# Altium schematic sheet DAM10_Relays.SchDoc
size A3
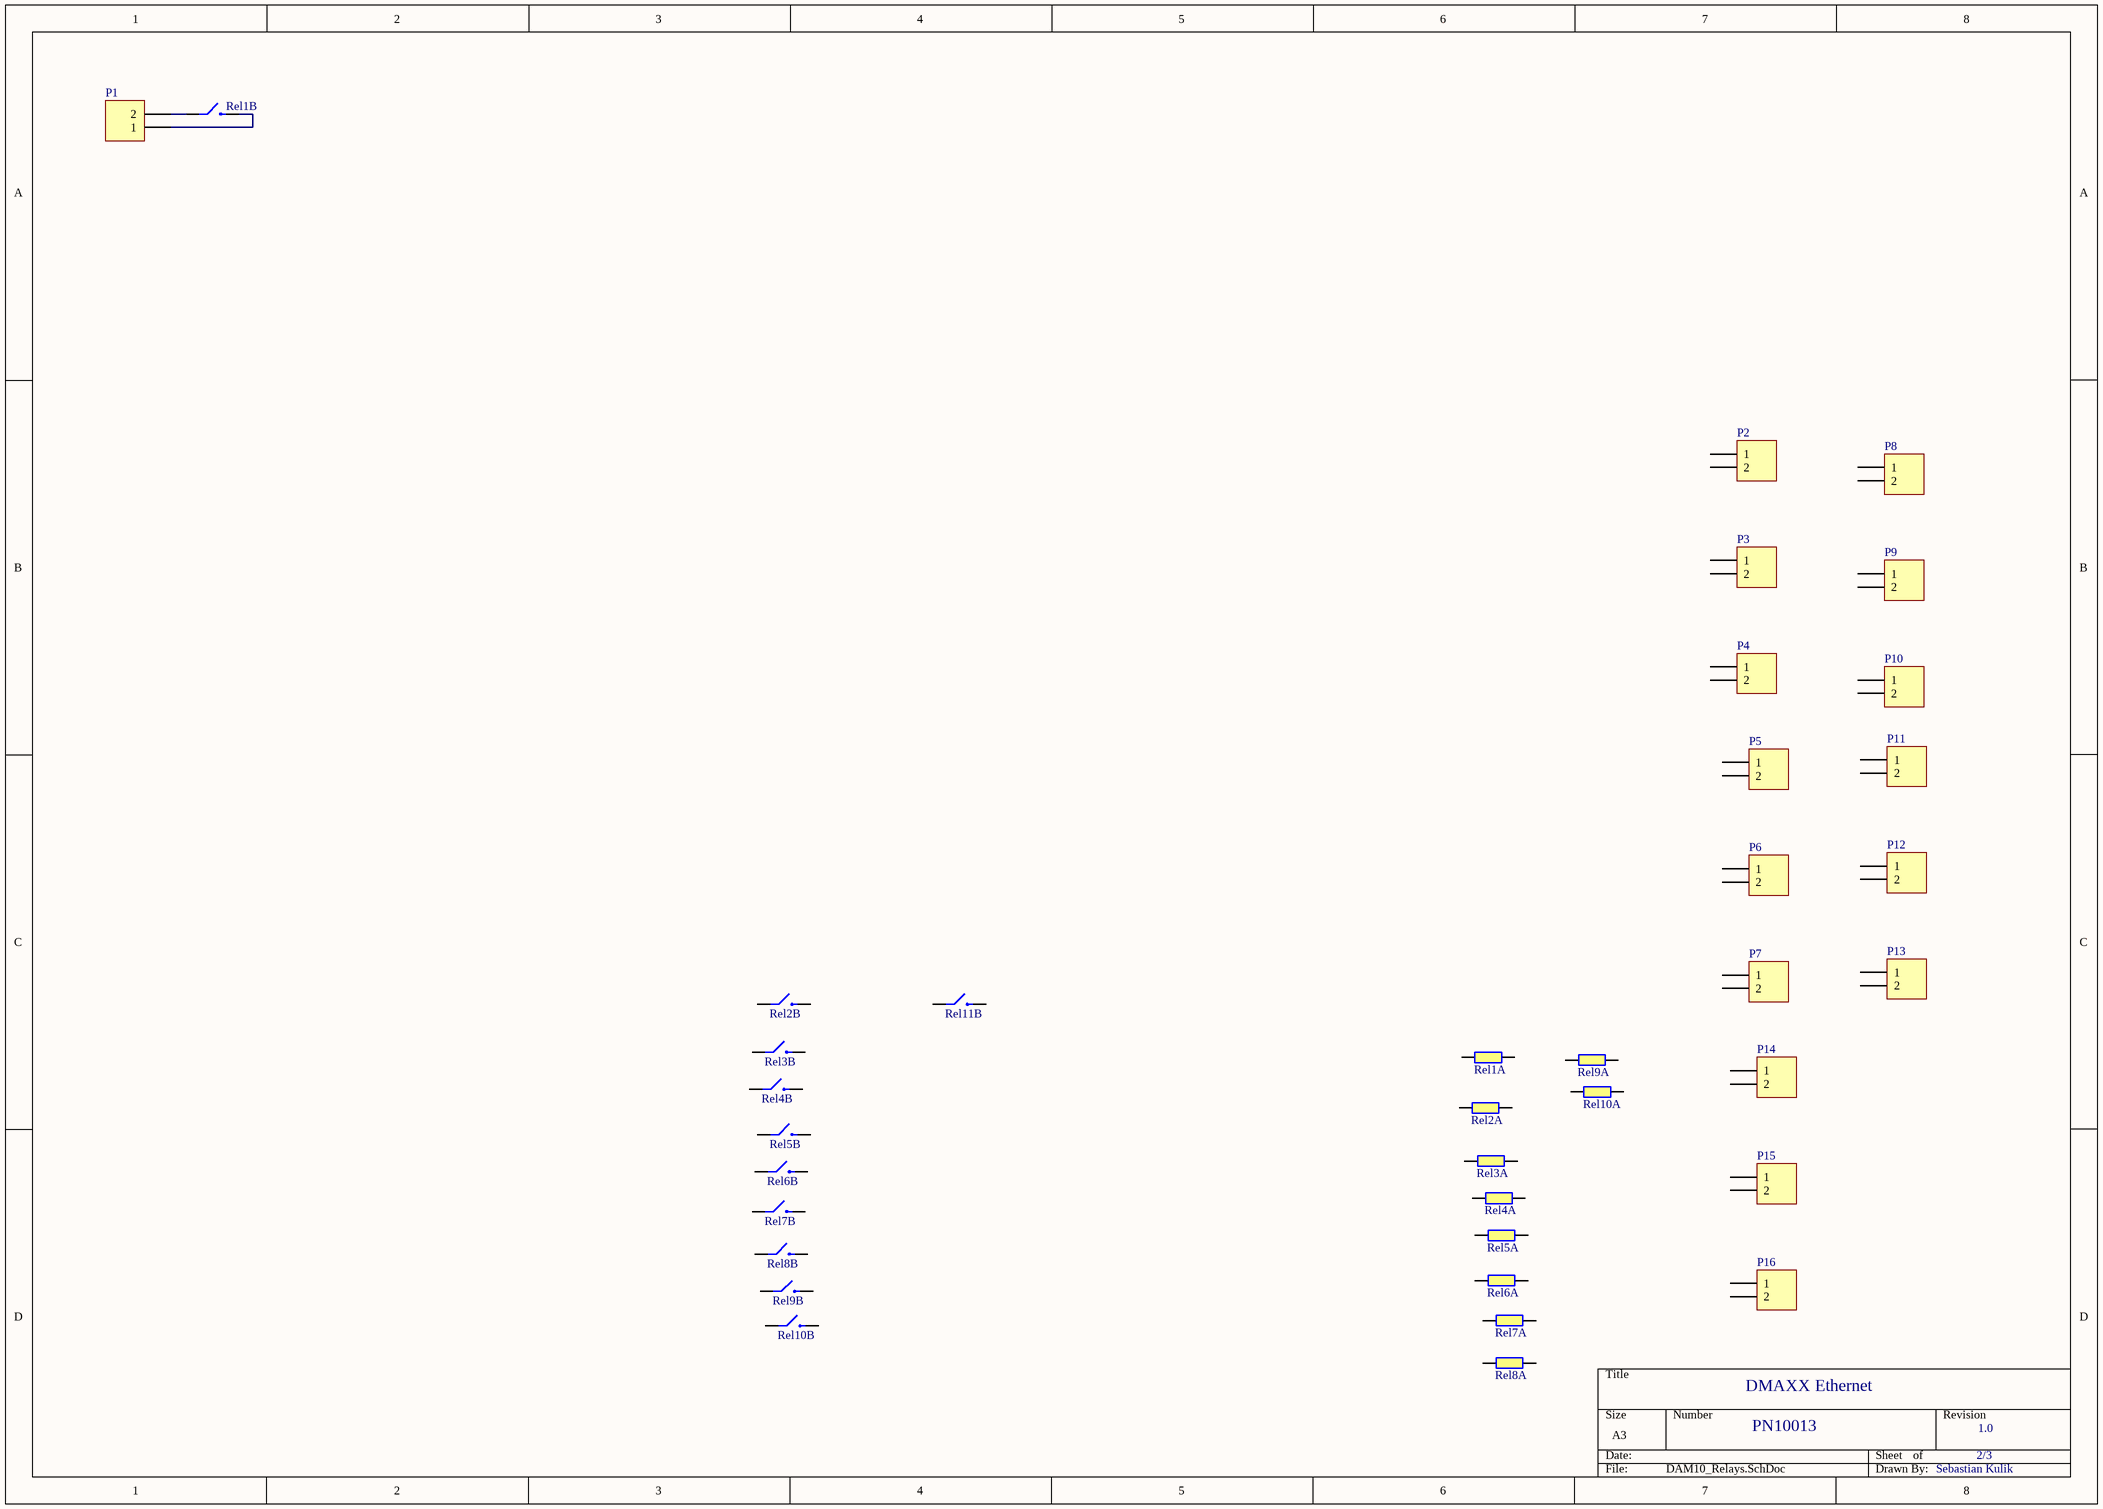
[diagram p0: DAM10_Relays.SchDoc]

## Parts
P1  PHOENIX_1715721  [Phoenix-2-5_08]  (value not drawn)
P2  PHOENIX_1715721  [Phoenix-2-5_08]  (value not drawn)
P3  PHOENIX_1715721  [Phoenix-2-5_08]  (value not drawn)
P4  PHOENIX_1715721  [Phoenix-2-5_08]  (value not drawn)
P5  PHOENIX_1715721  [Phoenix-2-5_08]  (value not drawn)
P6  PHOENIX_1715721  [Phoenix-2-5_08]  (value not drawn)
P7  PHOENIX_1715721  [Phoenix-2-5_08]  (value not drawn)
P8  PHOENIX_1715721  [Phoenix-2-5_08]  (value not drawn)
P9  PHOENIX_1715721  [Phoenix-2-5_08]  (value not drawn)
P10  PHOENIX_1715721  [Phoenix-2-5_08]  (value not drawn)
P11  PHOENIX_1715721  [Phoenix-2-5_08]  (value not drawn)
P12  PHOENIX_1715721  [Phoenix-2-5_08]  (value not drawn)
P13  PHOENIX_1715721  [Phoenix-2-5_08]  (value not drawn)
P14  PHOENIX_1715721  [Phoenix-2-5_08]  (value not drawn)
P15  PHOENIX_1715721  [Phoenix-2-5_08]  (value not drawn)
P16  PHOENIX_1715721  [Phoenix-2-5_08]  (value not drawn)
Rel1  Finder-43_41-Rel  [Finder-43_41 series]  (value not drawn)  (parts A,B of 2)
Rel2  Finder-43_41-Rel  [Finder-43_41 series]  (value not drawn)  (parts A,B of 2)
Rel3  Finder-43_41-Rel  [Finder-43_41 series]  (value not drawn)  (parts A,B of 2)
Rel4  Finder-43_41-Rel  [Finder-43_41 series]  (value not drawn)  (parts A,B of 2)
Rel5  Finder-43_41-Rel  [Finder-43_41 series]  (value not drawn)  (parts A,B of 2)
Rel6  Finder-43_41-Rel  [Finder-43_41 series]  (value not drawn)  (parts A,B of 2)
Rel7  Finder-43_41-Rel  [Finder-43_41 series]  (value not drawn)  (parts A,B of 2)
Rel8  Finder-43_41-Rel  [Finder-43_41 series]  (value not drawn)  (parts A,B of 2)
Rel9  Finder-43_41-Rel  [Finder-43_41 series]  (value not drawn)  (parts A,B of 2)
Rel10  Finder-43_41-Rel  [Finder-43_41 series]  (value not drawn)  (parts A,B of 2)
Rel11  Finder-43_41-Rel  [Finder-43_41 series]  (value not drawn)  (part B of 2)

## Nets
NetP1_1: P1.1 Rel1.4
NetP1_2: P1.2 Rel1.3

Not connected (* = marked no-connect by the designer): P2 1 2; P3 1 2; P4 1 2; P5 1 2; P6 1 2; P7 1 2; P8 1 2; P9 1 2; P10 1 2; P11 1 2; P12 1 2; P13 1 2; P14 1 2; P15 1 2; P16 1 2; Rel1 1 2; Rel2 1 2 3 4; Rel3 1 2 3 4; Rel4 1 2 3 4; Rel5 1 2 3 4; Rel6 1 2 3 4; Rel7 1 2 3 4; Rel8 1 2 3 4; Rel9 1 2 3 4; Rel10 1 2 3 4; Rel11 3 4

## Notes on the sheet
- DMAXX Ethernet
- PN10013
- 2/3
- 1.0
- Sebastian Kulik

## Library data of the parts
P1-P16 = 2Pol_1715721: Phoenix, 2 pol, 5.08mm, 22A, 715721; Deliverer PartNr: 3041529; Deliverer: Farnell; TDE-PN: CON0008; LatestRevisionDate: 02.05.2014; LatestRevisionNote: Re-released for DXP Platform.; Publisher: Sebastian Kulik; Manufacturer PartNr: 1715721; Manufacturer: Phoenix
Rel1-Rel11 = Finder-43_41-Rel: Finder-43-Relay, 16A, 12V, 400mW; Deliverer PartNr: 1217374; Manufacturer PartNr: 43.61.9.012.2300; Manufacturer: Finder; Deliverer: Farnell; TDE-PN: M0004; Published: 05.06.2014; PackageReference: Finder-43 series; Publisher: Sebastian Kulik